# EasyEDA Pro project ProPrj_Low Taper Fade_2026-04-30 (1).epro

# Schematic Schematic1
Board Name: Board1; Create Date: 2026-04-27; Page Name: P1; Project Name: Low Taper Fade; Schematic Name: Schematic1; Update Date: 2026-04-28; Company: EasyEDA.com; Page Size: A4; Version: V1.0
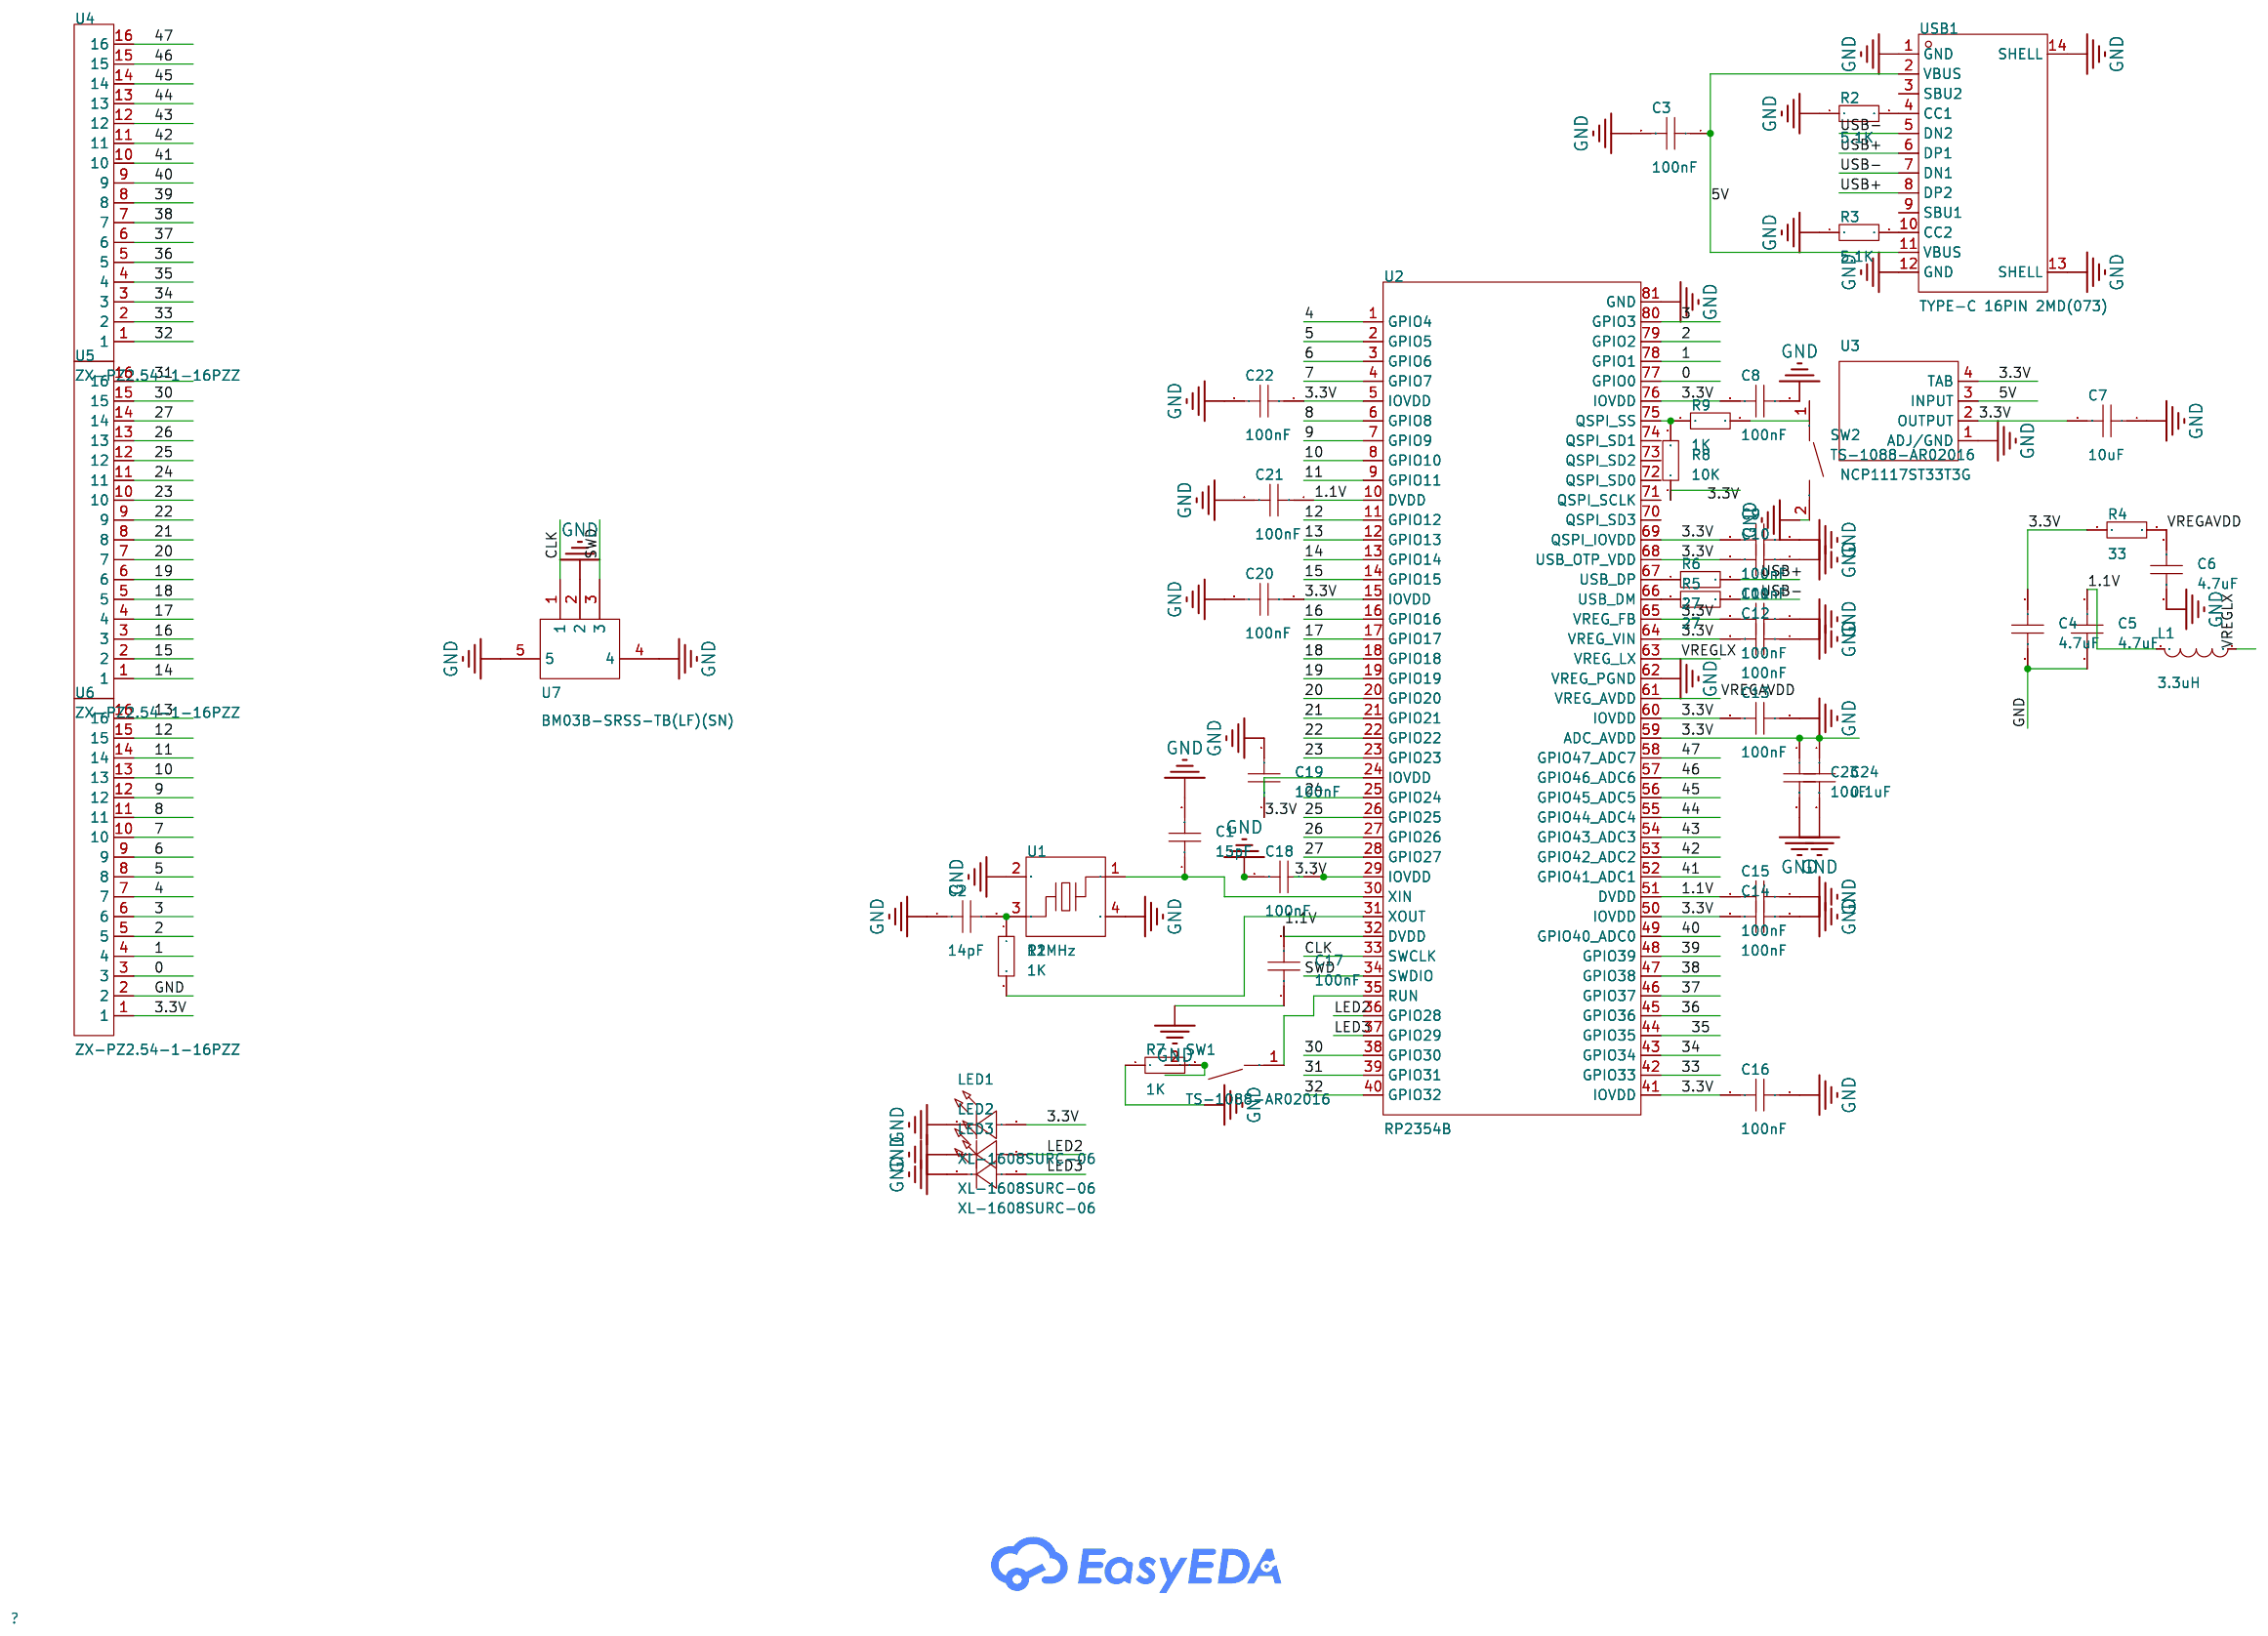
[diagram p0: schematic sheet]

## Parts
C1  15pF  [C0603]
C2  14pF  [C0603]
C3  100nF  [C0603]
C4  4.7uF  [C0603]
C5  4.7uF  [C0603]
C6  4.7uF  [C0603]
C7  10uF  [C0603]
C8  100nF  [C0603]
C9  100nF  [C0603]
C10  100nF  [C0603]
C11  100nF  [C0603]
C12  100nF  [C0603]
C13  100nF  [C0603]
C14  100nF  [C0603]
C15  100nF  [C0603]
C16  100nF  [C0603]
C17  100nF  [C0603]
C18  100nF  [C0603]
C19  100nF  [C0603]
C20  100nF  [C0603]
C21  100nF  [C0603]
C22  100nF  [C0603]
C23  10uF  [C0603]
C24  0.1uF  [C0603]
L1  3.3uH  [IND-SMD_L2.0-W1.6_AOTA-B201610S3R3-101-T]
LED1  XL-1608SURC-06  [LED0603-RD_RED]
LED2  XL-1608SURC-06  [LED0603-RD_RED]
LED3  XL-1608SURC-06  [LED0603-RD_RED]
R1  1K  [R0603]
R2  5.1K  [R0603]
R3  5.1K  [R0603]
R4  33  [R0603]
R5  27  [R0603]
R6  27  [R0603]
R7  1K  [R0603]
R8  10K  [R0603]
R9  1K  [R0603]
SW1  TS-1088-AR02016  [SW-SMD_L3.9-W3.0-P4.45]
SW2  TS-1088-AR02016  [SW-SMD_L3.9-W3.0-P4.45]
U1  12MHz  [CRYSTAL-SMD_4P-L3.2-W2.5-BL]
U2  RP2354B  [QFN-80_L10.0-W10.0-P0.40-TL-EP3.4]
U3  NCP1117ST33T3G  [SOT-223-3_L6.5-W3.4-P2.30-LS7.0-BR]
U4  ZX-PZ2.54-1-16PZZ  [HDR-TH_16P-P2.54-V-M-2]
U5  ZX-PZ2.54-1-16PZZ  [HDR-TH_16P-P2.54-V-M-2]
U6  ZX-PZ2.54-1-16PZZ  [HDR-TH_16P-P2.54-V-M-2]
U7  BM03B-SRSS-TB(LF)(SN)  [CONN-SMD-3P-P1.00_BM03B-SRSS-TB-LF-SN]
USB1  TYPE-C 16PIN 2MD(073)  [USB-C-SMD_TYPE-C-6PIN-2MD-073]

## Library data of the parts
C1-C24 = CAP_0603: Supplier Footprint: 0603
L1 = AOTA-B201610S3R3-101-T: Inductance:3.3uH Current Rating:2.1A Current - Saturation(Isat):2.4A DC Resistance(DCR):115mΩ Type:Molded Inductor; LCSC Part Name: 3.3uH 2.4A; Supplier Part: C42411119; Manufacturer: ABRACON; Supplier Footprint: 0806; JLCPCB Part Class: Extended Part; Datasheet: https://item.szlcsc.com/datasheet/AOTA-B201610S3R3-101-T/44392932.html; Supplier: LCSC; Current Rating: 2.1A; Current - Saturation(Isat): 2.4A; DC Resistance(DCR): 115mΩ; Type: Molded Inductor
LED1-LED3 = XL-1608SURC-06: Lamp Holder Type:- Illumination Color:Red Voltage - Forward(Vf):2.3V Voltage - Forward(Vf):2.3V Power(Watts):50mW Forward Current:20mA Wavelength - Dominant:620nm~630nm Wavelength - Dominant:620nm~630nm Peak Wavelength:625nm Diode Configuration:Discrete D; LCSC Part Name: 0603红色贴片式发光二极管; Supplier Part: C965799; Manufacturer: XINGLIGHT(成兴光); Supplier Footprint: 0603; JLCPCB Part Class: Extended Part; Datasheet: https://item.szlcsc.com/datasheet/XL-1608SURC-06/1051408.html; Supplier: LCSC; Illumination Color: Red; Voltage - Forward(Vf): 2.3V; Power(Watts): 50mW; Forward Current: 20mA; Wavelength - Dominant: 620nm~630nm; Peak Wavelength: 625nm; Diode Configuration: Discrete Diode; Lens Color: Water Clear; Luminous Intensity: 225mcd; Viewing Angle: 120°; Mounting Style: Top-mount; Operating Temperature: -40℃~+85℃
R1-R9 = Res_0603: Supplier Footprint: 0603
SW1 SW2 = TS-1088-AR02016: Circuit:SPST Actuator Style:Round Button Operating Force:1.6N Mounting Type:Surface Mount,Vertical Length:4mm Width:3mm Switch Height:2mm with Bracket:Without Bracket Contact Current:50mA Voltage Rating:12V Actuator/Cap Color:Black Termination Style:SMD(S; LCSC Part Name: 4*3*2mm 立贴 轻触开关; Supplier Part: C720477; Manufacturer: XUNPU(讯普); Supplier Footprint: SMD,4x3mm; JLCPCB Part Class: Basic Part; Datasheet: https://item.szlcsc.com/datasheet/TS-1088-AR02016/763484.html; Supplier: LCSC; Circuit: SPST; Actuator Style: Round Button; Operating Force: 1.6N; Mounting Type: Surface Mount,Vertical; Length: 4mm; Width: 3mm; Switch Height: 2mm; with Bracket: Without Bracket; Contact Current: 50mA; Voltage Rating: 12V; Actuator/Cap Color: Black; Termination Style: SMD(SMT) Tab; Life: 100,000 Cycles; Operating Temperature: -30℃~+80℃
U1 = ABM8-272-T3_C20625731: Type:Crystal Oscillator Frequency:12MHz Normal temperature Frequency Tolerance:±30ppm Normal temperature Frequency Tolerance:±30ppm Load Capacitance:10pF Frequency Stability:±30ppm Frequency Stability:±30ppm Equivalent Series Resistance(ESR):50Ω Operating; LCSC Part Name: 12MHz ±30ppm 10pF; Supplier Part: C20625731; Manufacturer: ABRACON; Manufacturer Part: ABM8-272-T3; Supplier Footprint: SMD3225-4P; JLCPCB Part Class: Extended Part; Datasheet: https://item.szlcsc.com/datasheet/ABM8-272-T3/22032038.html; Supplier: LCSC; Type: Crystal Oscillator; Normal temperature Frequency Tolerance: ±30ppm; Load Capacitance: 10pF; Frequency Stability: ±30ppm; Equivalent Series Resistance(ESR): 50Ω; Operating Temperature: -40℃~+85℃
U2 = RP2354B_C39843328: Features:True random number generator (TRNG)；External pin reset (NRST); LCSC Part Name: 高性能安全微控制器; Supplier Part: C39843328; Manufacturer: Raspberry Pi(树莓派); Supplier Footprint: QFN-80-EP(10x10); JLCPCB Part Class: Extended Part; Datasheet: https://item.szlcsc.com/datasheet/RP2354B/41574627.html; Supplier: LCSC; Features: True random number generator (TRNG)；External pin reset (NRST)
U3 = NCP1117ST33T3G: Output Type:Fixed Voltage - Supply:20V Output Voltage:3.3V Output Voltage:3.3V Output Current:1A Power Supply Rejection Ratio (PSRR):62dB@(120Hz) Voltage Dropout:1.2V@(800mA) standby current:6mA Noise:0.003%Vout Features:Thermal Shutdown；Over Current Prot; LCSC Part Name: 3.3V 1A 20V; Supplier Part: C26537; Manufacturer: onsemi(安森美); Supplier Footprint: SOT-223; JLCPCB Part Class: Extended Part; Datasheet: https://item.szlcsc.com/datasheet/NCP1117ST33T3G/27282.html; Supplier: LCSC; Output Type: Fixed; Voltage - Supply: 20V; Output Voltage: 3.3V; Output Current: 1A; Power Supply Rejection Ratio (PSRR): 62dB@(120Hz); Voltage Dropout: 1.2V@(800mA); standby current: 6mA; Noise: 0.003%Vout; Features: Thermal Shutdown；Over Current Protection; Operating Temperature: 0℃~+125℃@(Ta); Output Configuration: Positive; Number of Outputs: 1
U4-U6 = ZX-PZ2.54-1-16PZZ: Pin Structure:1x16P Pitch:2.54mm Row Spacing:- Circluar Pins/Square Pins:Pin Header Mounting Type:Through Hole Number of Rows:1 Number of Pins:16P Current Rating:3A Voltage Rating (Max):- Length of Mating Pin:6mm Insulation Height:2.5mm Length of End Conn; LCSC Part Name: 1x16P 间距:2.54mm 方针 直插; Supplier Part: C7501270; Manufacturer: Megastar(兆星); Supplier Footprint: 插件,P=2.54mm; JLCPCB Part Class: Extended Part; Datasheet: https://item.szlcsc.com/datasheet/ZX-PZ2.54-1-16PZZ/8582483.html; Supplier: LCSC; Pin Structure: 1x16P; Pitch: 2.54mm; Circluar Pins/Square Pins: Pin Header; Mounting Type: Through Hole; Number of Rows: 1; Number of Pins: 16P; Current Rating: 3A; Length of Mating Pin: 6mm; Insulation Height: 2.5mm; Length of End Connection Pin: 3mm; Contact Material: Brass; Contact Plating: Gold; Operating Temperature: -40℃~+105℃; Color: Black
U7 = BM03B-SRSS-TB(LF)(SN): Pins Structure:1x3P Pitch:1mm Mounting Type:Surface Mount,Vertical Reference Series:SH Number of Pins:3P Number of Rows:1 Number of PINs Per Row:3 Row Spacing:- Current Rating:1A Contact Material:Copper Alloy Contact Plating:Tin Operating Temperature:-25℃; LCSC Part Name: 1x3P 间距:1mm 立贴 系列:SH; Supplier Part: C160389; Manufacturer: JST; Supplier Footprint: SMD,P=1mm; JLCPCB Part Class: Extended Part; Datasheet: https://item.szlcsc.com/datasheet/BM03B-SRSS-TB(LF)(SN)/171769.html; Supplier: LCSC; Pins Structure: 1x3P; Pitch: 1mm; Mounting Type: Surface Mount,Vertical; Reference Series: SH; Number of Pins: 3P; Number of Rows: 1; Number of PINs Per Row: 3; Current Rating: 1A; Contact Material: Copper Alloy; Contact Plating: Tin; Operating Temperature: -25℃~+85℃; Voltage Rating: 50V; Plastic Material: PA; Flame Retardant Rating: UL94V-0; Supplementary Features: Auxiliary Solder Pin; Color: White; Z-Height of the Board: 4.25mm; X-Length of Bottom Edge on Board (Spacing Line): 5mm; Y-Width of Bottom Edge on Board: 3.6mm
USB1 = TYPE-C 16PIN 2MD(073): Connector Type:Type-C Protocol Standard:- Gender:Female Mounting Type:Surface Mount, Right Angle Number of Contacts:16P Number of Ports:1 Current Rating-Power:3A Voltage Rating:5V Connect-Disconnect Life:10,000 Cycles Supplementary Features:- Center Heigh; LCSC Part Name: Type-C 母 卧贴; Supplier Part: C2765186; Manufacturer: SHOU HAN(首韩); Supplier Footprint: SMD; JLCPCB Part Class: Extended Part; Datasheet: https://item.szlcsc.com/datasheet/TYPE-C%252016PIN%25202MD(073)/2901843.html; Supplier: LCSC; Connector Type: Type-C; Gender: Female; Mounting Type: Surface Mount, Right Angle; Number of Contacts: 16P; Number of Ports: 1; Current Rating-Power: 3A; Voltage Rating: 5V; Connect-Disconnect Life: 10,000 Cycles; Detection color: Black; Operating Temperature: -25℃~+85℃

## Nets
1.1V: C5.1 C15.2 C17.2 C21.1 L1.2 U2.10(DVDD) U2.32(DVDD) U2.51(DVDD)
3.3V: C4.1 C7.2 C8.2 C9.2 C10.2 C11.2 C12.2 C13.2 C14.2 C16.2 C18.1 C19.1 C20.1 C22.1 C23.1 C24.1 LED1.2(A) R4.1 R8.1 U2.5(IOVDD) U2.15(IOVDD) U2.24(IOVDD) U2.29(IOVDD) U2.41(IOVDD) U2.50(IOVDD) U2.59(ADC_AVDD) U2.60(IOVDD) U2.64(VREG_VIN) U2.65(VREG_FB) U2.68(USB_OTP_VDD) U2.69(QSPI_IOVDD) U2.76(IOVDD) U3.2(OUTPUT) U3.4(TAB) U6.1
5V: C3.1 U3.3(INPUT) USB1.2(VBUS) USB1.11(VBUS)
GND: C1.2 C2.1 C3.2 C4.2 C5.2 C6.2 C7.1 C8.1 C9.1 C10.1 C11.1 C12.1 C13.1 C14.1 C15.1 C16.1 C17.1 C18.2 C19.2 C20.2 C21.2 C22.2 C23.2 C24.2 LED1.1(K) LED2.1(K) LED3.1(K) R2.1 R3.1 R7.1 SW2.2 U1.2(GND) U1.4(GND) U2.62(VREG_PGND) U2.81(GND) U3.1(ADJ/GND) U6.2 U7.2 U7.4 U7.5 USB1.1(GND) USB1.12(GND) USB1.13(SHELL) USB1.14(SHELL)
0: U2.77(GPIO0) U6.3
1: U2.78(GPIO1) U6.4
2: U2.79(GPIO2) U6.5
3: U2.80(GPIO3) U6.6
4: U2.1(GPIO4) U6.7
5: U2.2(GPIO5) U6.8
6: U2.3(GPIO6) U6.9
7: U2.4(GPIO7) U6.10
8: U2.6(GPIO8) U6.11
9: U2.7(GPIO9) U6.12
10: U2.8(GPIO10) U6.13
11: U2.9(GPIO11) U6.14
12: U2.11(GPIO12) U6.15
13: U2.12(GPIO13) U6.16
14: U2.13(GPIO14) U5.1
15: U2.14(GPIO15) U5.2
16: U2.16(GPIO16) U5.3
17: U2.17(GPIO17) U5.4
18: U2.18(GPIO18) U5.5
19: U2.19(GPIO19) U5.6
20: U2.20(GPIO20) U5.7
21: U2.21(GPIO21) U5.8
22: U2.22(GPIO22) U5.9
23: U2.23(GPIO23) U5.10
24: U2.25(GPIO24) U5.11
25: U2.26(GPIO25) U5.12
26: U2.27(GPIO26) U5.13
27: U2.28(GPIO27) U5.14
30: U2.38(GPIO30) U5.15
31: U2.39(GPIO31) U5.16
32: U2.40(GPIO32) U4.1
33: U2.42(GPIO33) U4.2
34: U2.43(GPIO34) U4.3
35: U2.44(GPIO35) U4.4
36: U2.45(GPIO36) U4.5
37: U2.46(GPIO37) U4.6
38: U2.47(GPIO38) U4.7
39: U2.48(GPIO39) U4.8
40: U2.49(GPIO40_ADC0) U4.9
41: U2.52(GPIO41_ADC1) U4.10
42: U2.53(GPIO42_ADC2) U4.11
43: U2.54(GPIO43_ADC3) U4.12
44: U2.55(GPIO44_ADC4) U4.13
45: U2.56(GPIO45_ADC5) U4.14
46: U2.57(GPIO46_ADC6) U4.15
47: U2.58(GPIO47_ADC7) U4.16
CLK: U2.33(SWCLK) U7.1
LED2: LED2.2(A) U2.36(GPIO28)
LED3: LED3.2(A) U2.37(GPIO29)
SWD: U2.34(SWDIO) U7.3
USB+: R6.2 USB1.6(DP1) USB1.8(DP2)
USB-: R5.2 USB1.5(DN2) USB1.7(DN1)
VREGAVDD: C6.1 R4.2 U2.61(VREG_AVDD)
VREGLX: L1.1 U2.63(VREG_LX)
$1N996: C1.1 U1.1 U2.30(XIN)
$1N1154: C2.2 R1.1 U1.3
$1N1283: R1.2 U2.31(XOUT)
$1N1709: R2.2 USB1.4(CC1)
$1N1735: R3.2 USB1.10(CC2)
$1N2843: R5.1 U2.66(USB_DM)
$1N2869: R6.1 U2.67(USB_DP)
$1N3149: R8.2 R9.2 U2.75(QSPI_SS)
Net-(R7-2): R7.2 SW1.2
Net-(R9-1): R9.1 SW2.1
Net-(SW1-1): SW1.1 U2.35(RUN)

Not connected (* = marked no-connect by the designer): U2 70(QSPI_SD3) 71(QSPI_SCLK) 72(QSPI_SD0) 73(QSPI_SD2) 74(QSPI_SD1); USB1 3(SBU2) 9(SBU1)

# Board PCB2
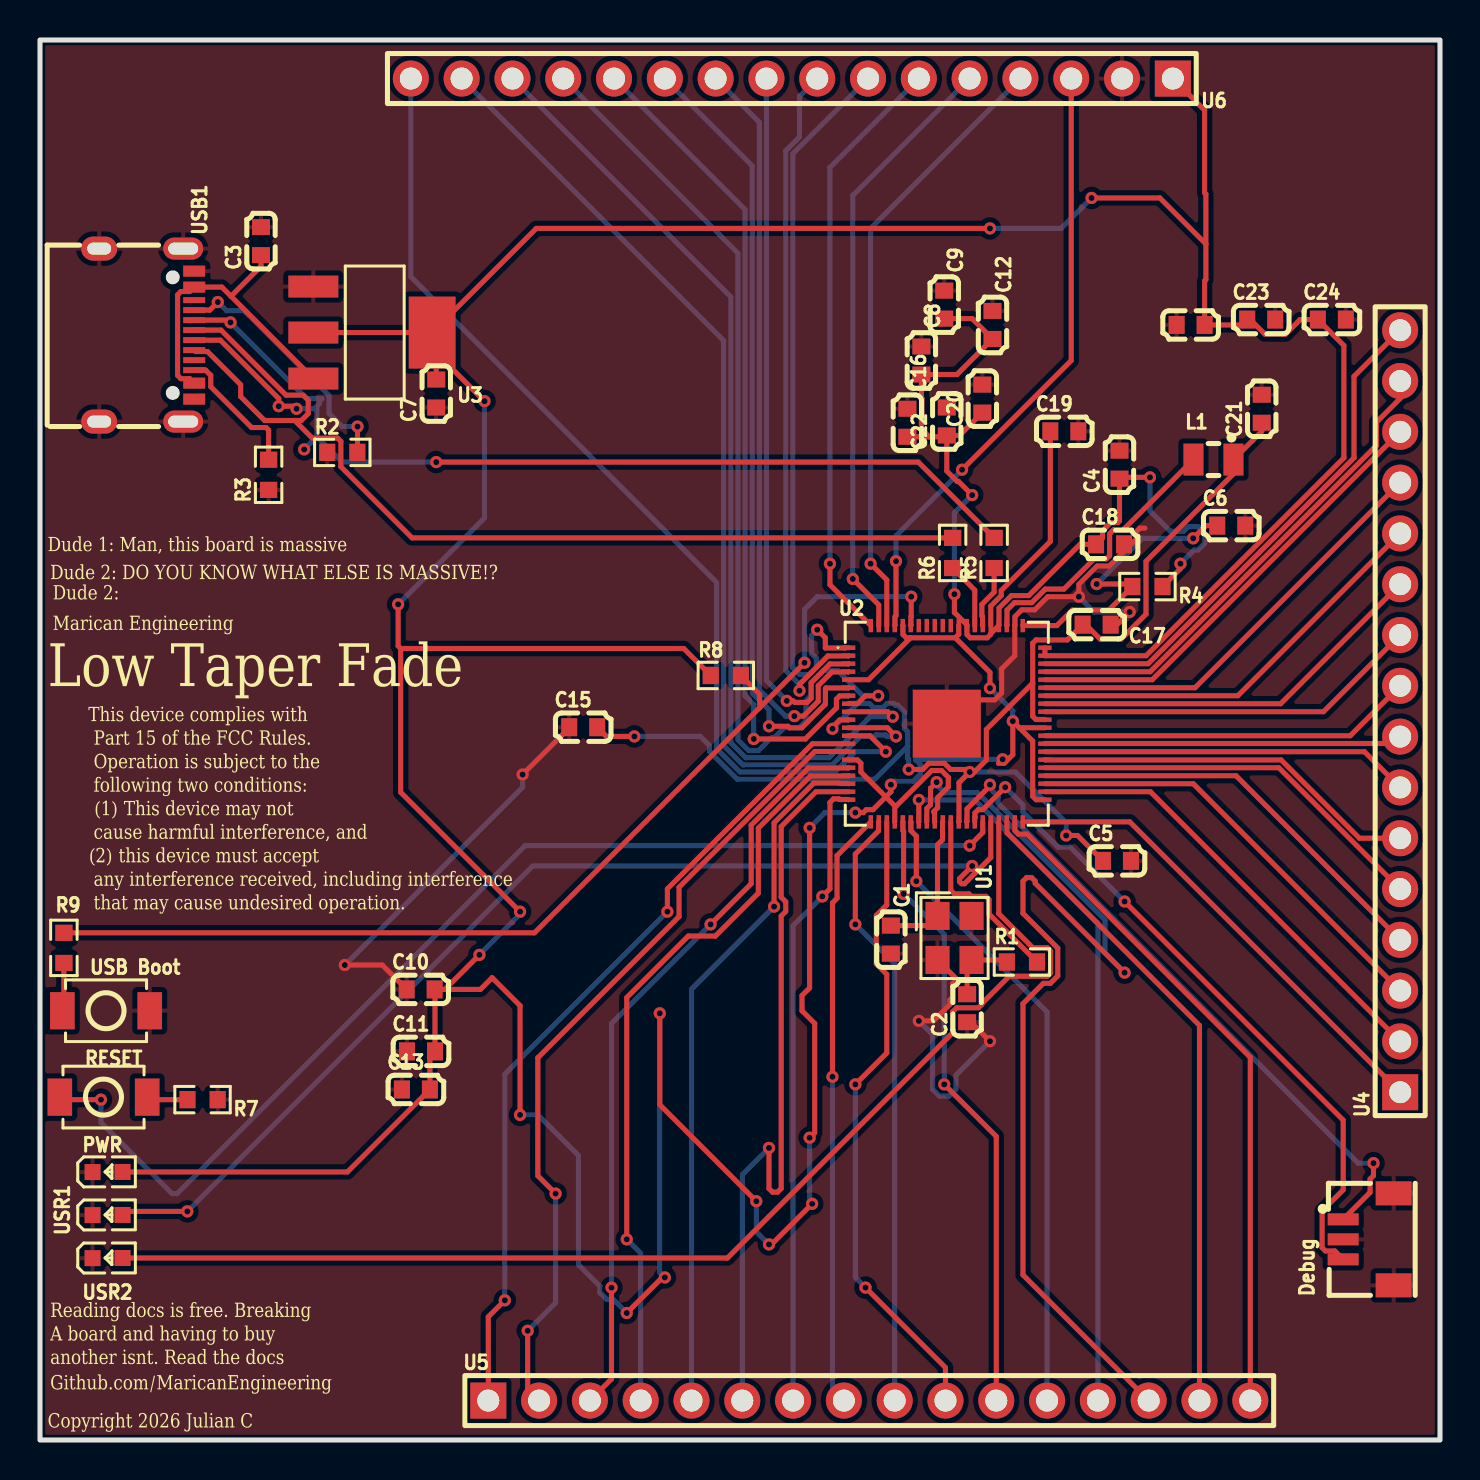
[diagram p1: board, top side]
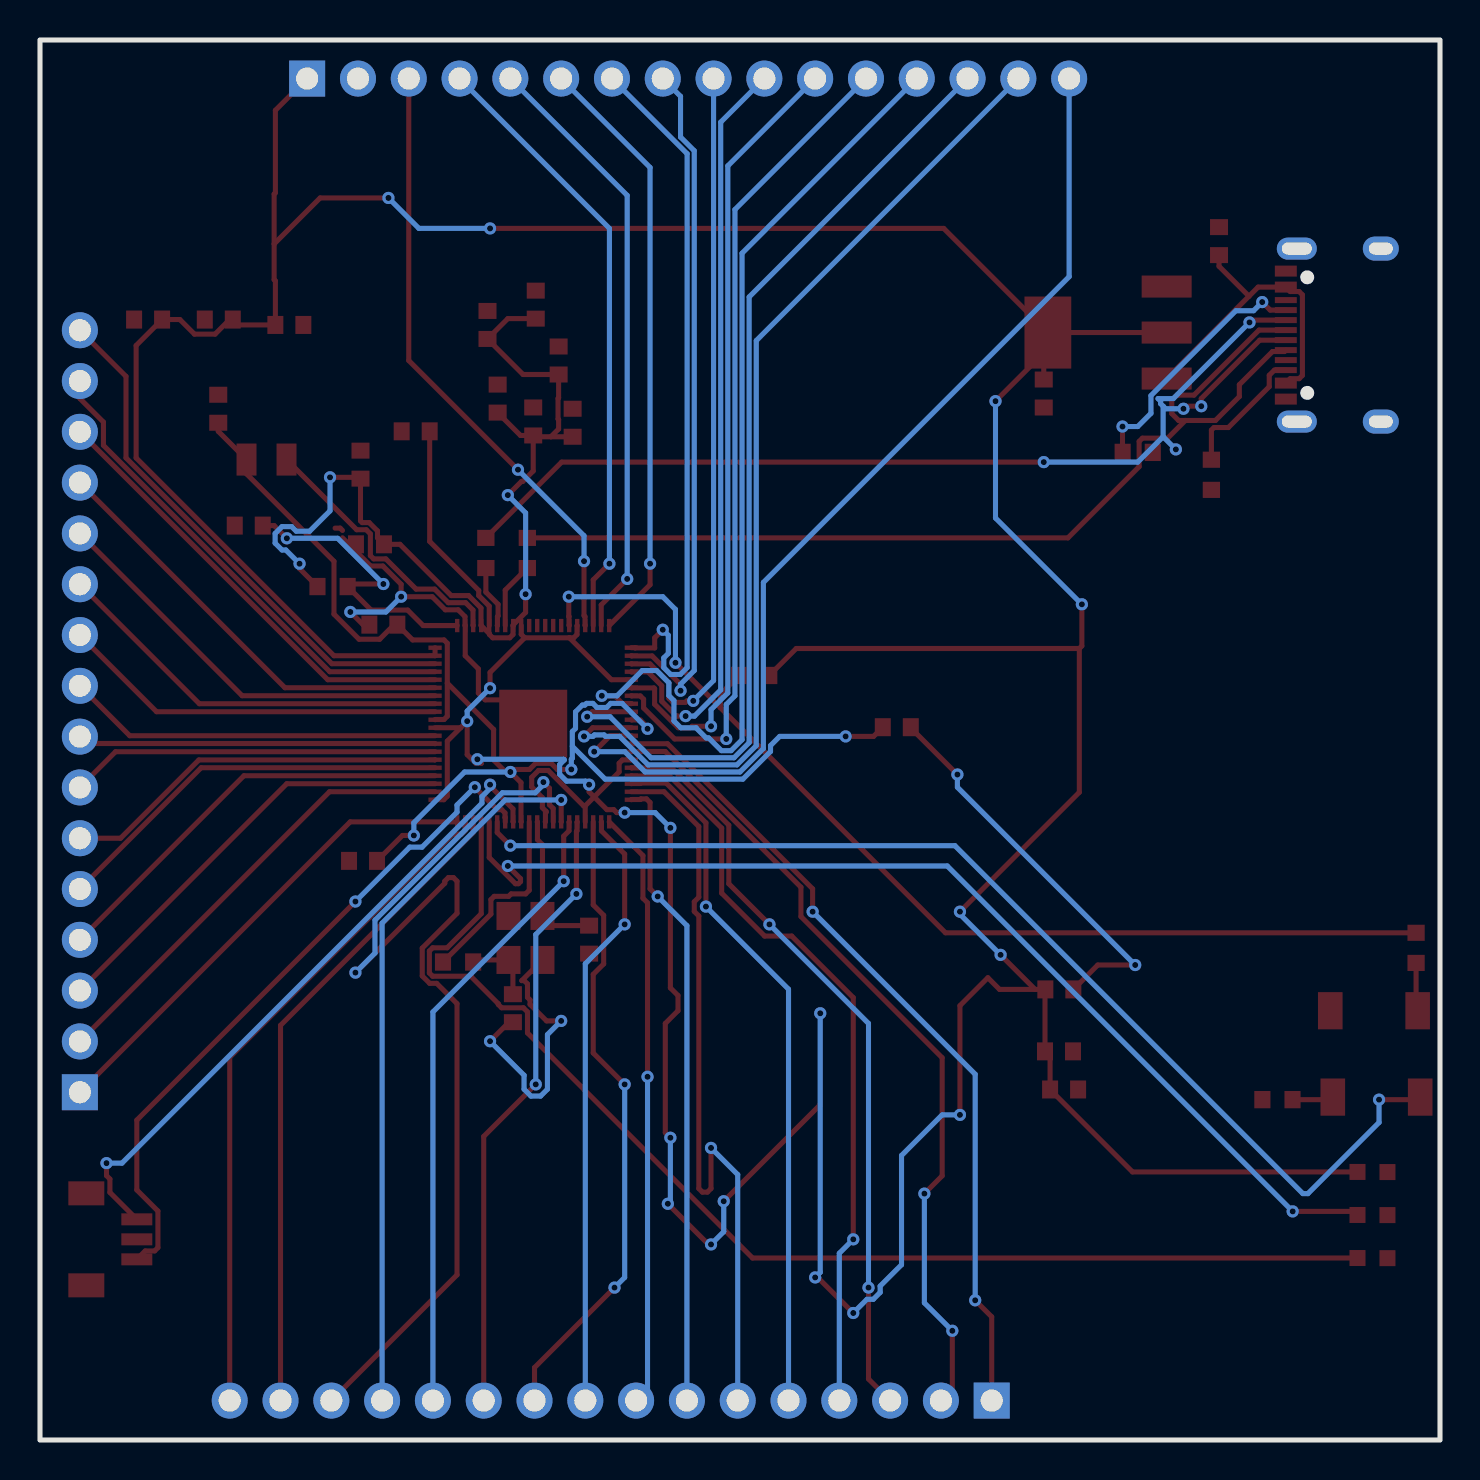
[diagram p2: board, bottom side, seen from below]

Outline 70 x 70 mm; copper layers: Top Layer, Bottom Layer. Coordinates in mm from the lower left corner of the outline.
Outline path: rectangle 0,70 70,0
Stack: Top Layer 0.035mm / Dielectric1 1.51mm FR4 er 4.5 / Bottom Layer 0.035mm

## Design rules (mm)
template: JLCPCB Capability(Two Layers Board)
spacing copperThickness1oz (default): track to track 0.102, other pairs 0.152 to 0.3
spacing copperThickness2oz: track to track 0.203, other pairs 0.152 to 0.3
track width copperThickness1oz (default): min 0.127, default 0.254, max 2.54
track width copperThickness2oz: min 0.203, default 0.254, max 2.54
differential pair differentialPair (default): width min 0.127, default 0.254, max 2.54; gap min 0.152, default 0.152
via viaSize (default): diameter min 0.5, default 0.61, max 10; hole min 0.3, default 0.305, max 6.3

## Placement (name value [footprint] x y rotation side)
C1  15pF  [C0603]  42.54 25.02 270 top
C2  14pF  [C0603]  46.35 21.59 90 top
C3  100nF  [C0603]  11.05 59.94 90 top
C4  4.7uF  [C0603]  53.97 48.77 90 top
C5  4.7uF  [C0603]  53.85 28.96 0 top
C6  4.7uF  [C0603]  59.56 45.72 0 top
C7  10uF  [C0603]  19.81 52.32 90 top
C8  100nF  [C0603]  44.07 53.97 270 top
C9  100nF  [C0603]  45.21 56.77 270 top
C10  100nF  [C0603]  19.03 22.53 0 top
C11  100nF  [C0603]  19.05 19.43 0 top
C12  100nF  [C0603]  47.62 55.75 270 top
C13  100nF  [C0603]  18.8 17.53 0 top
C14  100nF  [C0603]  57.53 55.75 0 top
C15  100nF  [C0603]  27.16 35.64 0 top
C16  100nF  [C0603]  43.37 50.86 270 top
C17  100nF  [C0603]  52.83 40.77 180 top
C18  100nF  [C0603]  53.5 44.78 0 top
C19  100nF  [C0603]  51.22 50.43 0 top
C20  100nF  [C0603]  47.12 52.07 90 top
C21  100nF  [C0603]  61.09 51.56 90 top
C22  100nF  [C0603]  45.34 50.93 90 top
C23  10uF  [C0603]  61.06 56.02 0 top
C24  0.1uF  [C0603]  64.59 56.02 0 top
Debug  BM03B-SRSS-TB(LF)(SN)  [CONN-SMD-3P-P1.00_BM03B-SRSS-TB-LF-SN]  66.42 10.03 90 top
L1  3.3uH  [IND-SMD_L2.0-W1.6_AOTA-B201610S3R3-101-T]  58.67 49.02 0 top
PWR  XL-1608SURC-06  [LED0603-RD_RED]  3.38 13.4 0 top
R1  1K  [R0603]  49.1 23.9 0 top
R2  5.1K  [R0603]  15.11 49.38 0 top
R3  5.1K  [R0603]  11.43 48.26 90 top
R4  33  [R0603]  55.37 42.67 180 top
R5  27  [R0603]  47.71 44.35 90 top
R6  27  [R0603]  45.63 44.35 90 top
R7  1K  [R0603]  8.13 17.02 180 top
R8  10K  [R0603]  34.29 38.23 0 top
R9  1K  [R0603]  1.2 24.61 90 top
RESET  TS-1088-AR02016  [SW-SMD_L3.9-W3.0-P4.45]  3.17 17.14 0 top
U1  12MHz  [CRYSTAL-SMD_4P-L3.2-W2.5-BL]  45.73 25.1 270 top
U2  RP2354B  [QFN-80_L10.0-W10.0-P0.40-TL-EP3.4]  45.34 35.81 0 top
U3  NCP1117ST33T3G  [SOT-223-3_L6.5-W3.4-P2.30-LS7.0-BR]  16.64 55.37 180 top
U4  ZX-PZ2.54-1-16PZZ  [HDR-TH_16P-P2.54-V-M-2]  68.01 36.44 90 top
U5  ZX-PZ2.54-1-16PZZ  [HDR-TH_16P-P2.54-V-M-2]  41.46 1.97 0 top
U6  ZX-PZ2.54-1-16PZZ  [HDR-TH_16P-P2.54-V-M-2]  37.59 68.07 180 top
USB1  TYPE-C 16PIN 2MD(073)  [USB-C-SMD_TYPE-C-6PIN-2MD-073]  5.33 55.25 270 top
USB Boot  TS-1088-AR02016  [SW-SMD_L3.9-W3.0-P4.45]  3.3 21.46 0 top
USR1  XL-1608SURC-06  [LED0603-RD_RED]  3.38 11.25 0 top
USR2  XL-1608SURC-06  [LED0603-RD_RED]  3.38 9.1 0 top

## Footprints (pads in the part's own frame, mm; a bottom-side part is the same pattern mirrored in y, then rotated)
C0603
  rect 0.8x0.9 smd: 1(-0.7,0) 2(0.7,0)
CONN-SMD-3P-P1.00_BM03B-SRSS-TB-LF-SN
  rect 0.6x1.55 smd: 1(1,1.262) 2(0,1.262) 3(-1,1.262)
  rect 1.2x1.8 smd: 4(2.3,-1.262) 5(-2.3,-1.262)
CRYSTAL-SMD_4P-L3.2-W2.5-BL
  rect 1.4x1.2 smd: 1(-1.1,-0.85) 2(1.1,-0.85) 3(1.1,0.85) 4(-1.1,0.85)
HDR-TH_16P-P2.54-V-M-2
  rect 1.8x1.8 hole 1.1: 1(-19.05,0)
  round 1.8 hole 1.1: 2(-16.51,0) 3(-13.97,0) 4(-11.43,0) 5(-8.89,0) 6(-6.35,0) 7(-3.81,0) 8(-1.27,0) 9(1.27,0) 10(3.81,0) 11(6.35,0) 12(8.89,0) 13(11.43,0) 14(13.97,0) 15(16.51,0) 16(19.05,0)
IND-SMD_L2.0-W1.6_AOTA-B201610S3R3-101-T
  rect 1x1.6 smd: 1(-1,0) 2(1,0)
LED0603-RD_RED
  rect 0.8x0.8 smd: 1(-0.749,-0.004) 2(0.749,0.004)
QFN-80_L10.0-W10.0-P0.40-TL-EP3.4
  rect 0.665x0.22 smd: 1(-4.907,3.8) 2(-4.907,3.4) 3(-4.907,3) 4(-4.907,2.6) 5(-4.907,2.2) 6(-4.907,1.8) 7(-4.907,1.4) 8(-4.907,1) 9(-4.907,0.6) 10(-4.907,0.2) 11(-4.907,-0.2) 12(-4.907,-0.6) 13(-4.907,-1) 14(-4.907,-1.4) 15(-4.907,-1.8) 16(-4.907,-2.2) 17(-4.907,-2.6) 18(-4.907,-3) 19(-4.907,-3.4) 20(-4.907,-3.8) 41(4.907,-3.8) 42(4.907,-3.4) 43(4.907,-3) 44(4.907,-2.6) 45(4.907,-2.2) 46(4.907,-1.8) 47(4.907,-1.4) 48(4.907,-1) 49(4.907,-0.6) 50(4.907,-0.2) 51(4.907,0.2) 52(4.907,0.6) 53(4.907,1) 54(4.907,1.4) 55(4.907,1.8) 56(4.907,2.2) 57(4.907,2.6) 58(4.907,3) 59(4.907,3.4) 60(4.907,3.8)
  rect 0.22x0.665 smd: 21(-3.8,-4.907) 22(-3.4,-4.907) 23(-3,-4.907) 24(-2.6,-4.907) 25(-2.2,-4.907) 26(-1.8,-4.907) 27(-1.4,-4.907) 28(-1,-4.907) 29(-0.6,-4.907) 30(-0.2,-4.907) 31(0.2,-4.907) 32(0.6,-4.907) 33(1,-4.907) 34(1.4,-4.907) 35(1.8,-4.907) 36(2.2,-4.907) 37(2.6,-4.907) 38(3,-4.907) 39(3.4,-4.907) 40(3.8,-4.907) 61(3.8,4.907) 62(3.4,4.907) 63(3,4.907) 64(2.6,4.907) 65(2.2,4.907) 66(1.8,4.907) 67(1.4,4.907) 68(1,4.907) 69(0.6,4.907) 70(0.2,4.907) 71(-0.2,4.907) 72(-0.6,4.907) 73(-1,4.907) 74(-1.4,4.907) 75(-1.8,4.907) 76(-2.2,4.907) 77(-2.6,4.907) 78(-3,4.907) 79(-3.4,4.907) 80(-3.8,4.907)
  rect 3.4x3.4 smd: 81(0,0)
R0603
  rect 0.806x0.864 smd: 1(-0.753,0) 2(0.753,0)
SOT-223-3_L6.5-W3.4-P2.30-LS7.0-BR
  rect 2.5x1.1 smd: 1(2.97,-2.3) 2(2.97,0) 3(2.97,2.3)
  rect 2.34x3.6 smd: 4(-2.97,0)
SW-SMD_L3.9-W3.0-P4.45
  rect 1.23x1.86 smd: 1(-2.185,0) 2(2.185,0)
USB-C-SMD_TYPE-C-6PIN-2MD-073
  rect 0.55x1.1 smd: 1(-3.2,2.375) 2(-2.4,2.375) 11(2.4,2.375) 12(3.2,2.375)
  rect 0.3x1.1 smd: 3(-1.75,2.375) 4(-1.25,2.375) 5(-0.75,2.375) 6(-0.25,2.375) 7(0.25,2.375) 8(0.75,2.375) 9(1.25,2.375) 10(1.75,2.375)
  oval 1.1x2 hole 0.6x1.5: 13(-4.325,1.825) 14(4.325,1.825)
  oval 1.2x1.8 hole 0.6x1.2: 13(-4.325,-2.375) 14(4.325,-2.375)

## Nets
As in the schematic, except:
3.3V: C4.1 C7.2 C8.2 C9.2 C10.2 C11.2 C12.2 C13.2 C14.2 C16.2 C18.1 C19.1 C20.1 C22.1 C23.1 C24.1 PWR.2 R4.1 R8.1 U2.5 U2.15 U2.24 U2.29 U2.41 U2.50 U2.59 U2.60 U2.64 U2.65 U2.68 U2.69 U2.76 U3.2 U3.4 U6.1
GND: C1.2 C2.1 C3.2 C4.2 C5.2 C6.2 C7.1 C8.1 C9.1 C10.1 C11.1 C12.1 C13.1 C14.1 C15.1 C16.1 C17.1 C18.2 C19.2 C20.2 C21.2 C22.2 C23.2 C24.2 Debug.2 Debug.4 Debug.5 PWR.1 R2.1 R3.1 R7.1 U1.2 U1.4 U2.62 U2.81 U3.1 U6.2 USB1.1 USB1.12 USB1.13 USB1.14 USB Boot.2 USR1.1 USR2.1
CLK: Debug.1 U2.33
LED2: U2.36 USR1.2
LED3: U2.37 USR2.2
SWD: Debug.3 U2.34
$1N3024: RESET.1 U2.35
$1N3050: R7.2 RESET.2
$1N3281: R9.1 USB Boot.1

Pads without a net: U2 70 71 72 73 74; USB1 3 9

## Via types
v1: diameter 0.61, hole 0.305, Top Layer to Bottom Layer, 89 vias

## Routing (per net, layer and track width the routed paths; a pad name or vN(x,y) marks a point on that pad's centre or on a via; arc(x,y) is an arc through that point)
1.1V: length 69.9
  Top Layer w0.254: v1(46.48,33.4) 46.72,33.4 47.32,34 47.32,35.53 49.63,37.84 ; v1(46.48,33.4) 45.95,32.87 45.95,30.92 U2.32 ; v1(46.48,33.4) 46.35,33.53 45.53,33.53 45.22,33.83 44.44,33.83 44.14,33.53 v1(43.43,33.53) ; C15.2 28.32,35.18 v1(29.72,35.18) ; 49.63,37.84 49.63,36.19 49.8,36.03 50.24,36.03 U2.51 ; 49.63,37.84 49.63,39.84 49.8,40 51.37,40 C17.2 52.29,40.77 53.02,40.04 54.05,40.04 55.3,41.29 55.3,43.94 59.67,48.31 L1.2 61.09,50.44 C21.1 ; v1(39.62,35.56) 39.62,35.64 39.98,36 40.42,36 U2.10 ; v1(51.31,30.23) 51.88,30.23 C5.1
  Bottom Layer w0.254: 43.38,34.68 41.74,33.04 34.86,33.04 33.47,34.43 33.47,34.72 33.01,35.18 v1(29.72,35.18) ; 43.38,34.68 43.38,34.09 43.43,34.04 v1(43.43,33.53) ; 43.38,34.68 43.38,35.42 43.22,35.58 43.22,36.41 42.88,36.75 42.75,36.75 42.67,36.83 42.35,36.83 42.15,36.63 41.67,36.63 41.47,36.83 40.89,36.83 v1(39.62,35.56) ; v1(51.31,30.23) 51.31,30.86 48.77,33.4 v1(46.48,33.4)
3.3V: length 353.2
  Top Layer w0.254: v1(24,26.42) 18.03,32.39 18.03,39.58 ; C22.1 45.34,48.45 45.86,47.93 45.92,47.93 v1(46.61,47.24) ; C22.1 45.97,50.23 C20.1 ; C22.1 45.27,50.16 44.46,50.16 ; U2.15 40.44,34 40.88,34 41.04,33.84 41.04,33.4 42.29,32.15 ; C7.2 19.81,54.36 v1(22.22,51.94) ; 44.46,50.16 44.07,50.55 44.07,51.02 44.1,51.05 44.1,52.08 44.07,52.11 44.07,53.28 45.85,53.28 C12.2 46.61,56.07 C9.2 ; 44.46,50.16 C16.2 ; 60.52,56.02 60.36,56.02 ; 60.52,56.02 60.25,55.75 C14.2 58.23,57.95 58.29,58.02 58.29,59.8 ; 60.52,56.02 61.25,55.29 62.28,55.29 63.01,56.02 C24.1 65.19,54.72 65.19,49.11 55.3,39.21 U2.59 U2.60 ; v1(42.54,32.77) 42.54,32.41 42.29,32.15 ; U2.41 49.81,32.01 49.63,32.19 49.63,34.95 48.97,35.61 ; v1(38.48,30.61) 38.48,22.61 38.1,22.22 38.1,21.46 38.74,20.83 38.74,15.37 v1(38.48,15.11) ; U2.5 41.43,38.01 43.53,40.11 ; v1(57.02,43.81) 57.02,43.57 R4.1 ; v1(55.5,48.13) 54.04,48.13 C4.1 53.97,45.96 53.89,45.87 53.54,45.87 53.12,45.45 53.12,45.11 C18.1 52,44.78 49.44,42.22 48.57,42.22 47.95,41.6 47.95,40.73 U2.64 47.53,40.31 47.53,40.27 47.36,40.11 46.51,40.11 46.35,40.27 46.35,40.71 U2.68 46.34,40.76 45.72,41.38 v1(45.72,42.29) ; 48.97,35.61 v1(48.64,35.94) 48.64,34.27 48.21,33.83 47.93,33.83 v1(48.13,34.04) ; 48.97,35.61 U2.50 ; v1(30.99,21.34) 30.99,16.76 v1(35.81,11.94) ; 58.29,59.8 55.99,62.1 v1(52.58,62.1) ; 58.29,59.8 58.29,62.3 58.23,62.36 58.23,66.48 U6.1 ; 20.24,22.53 C10.2 19.75,22.51 C11.2 19.5,19.18 C13.2 15.37,13.4 PWR.2 ; 20.24,22.53 v1(21.97,24.26) ; 20.24,22.53 22.02,22.53 22.61,23.11 24,21.72 v1(24,16.26) ; 43.53,40.11 43.31,40.11 43.15,40.27 43.15,40.71 U2.76 ; 43.53,40.11 45.76,40.11 ; 45.76,40.11 45.94,40.28 U2.69 ; 45.76,40.11 47.5,38.38 v1(47.5,37.59) ; U3.2 U3.4 24.81,60.58 v1(47.5,60.58) ; R8.1 32.19,39.58 18.03,39.58 ; 18.03,39.58 17.91,39.7 v1(17.91,41.78) ; v1(38.61,11.81) 36.58,9.78 v1(36.45,9.78) ; v1(40.77,31.37) 41.16,31.37 41.31,31.52 41.65,31.52 42.29,32.15 ; 42.74,31.71 U2.24 ; 42.74,31.71 42.29,32.15 ; 42.74,31.71 42.82,31.71 44.59,33.48 45.07,33.48 45.41,33.14 45.41,32.65 44.88,32.12 44.88,31.61 44.69,31.43 44.69,31.39 44.73,31.35 44.73,30.92 U2.29 ; U2.65 47.54,41.7 48.06,42.22 48.06,42.47 50.52,44.93 C19.1 ; v1(29.34,6.35) 31.12,8.13 v1(31.24,8.13)
  Bottom Layer w0.254: v1(57.02,43.81) 57.71,44.5 57.9,44.5 58.24,44.84 58.24,45.33 57.9,45.67 57.42,45.67 57.19,45.44 56.51,45.44 55.5,46.46 v1(55.5,48.13) ; v1(48.13,34.04) 43.81,34.04 43.79,34.01 43.79,34 44.02,33.77 44.02,33.29 43.68,32.94 42.72,32.94 v1(42.54,32.77) ; v1(21.97,24.26) 24,26.29 v1(24,26.42) ; v1(52.58,62.1) 51.05,60.58 v1(47.5,60.58) ; v1(38.48,15.11) 38.48,11.94 v1(38.61,11.81) ; v1(47.5,37.59) 48.64,36.45 v1(48.64,35.94) ; v1(22.22,51.94) 22.22,46.1 v1(17.91,41.78) ; v1(45.72,42.29) 45.72,46.36 v1(46.61,47.24) ; v1(36.45,9.78) 35.81,10.41 v1(35.81,11.94) ; v1(29.34,6.35) 28.65,7.04 28.33,7.04 27.99,7.38 27.99,7.7 26.92,8.76 26.92,14.22 24.89,16.26 v1(24,16.26) ; v1(30.99,21.34) 30.99,8.38 v1(31.24,8.13) ; v1(38.48,30.61) 39.24,31.37 v1(40.77,31.37)
5V: length 16.5
  Top Layer w0.254: USB1.11 7.49,53.07 7.04,53.07 6.88,53.23 6.88,57.26 7.04,57.42 7.49,57.42 7.71,57.64 9.09,57.64 9.55,57.19 ; 9.55,57.19 U3.3 ; 9.55,57.19 11.05,58.69 C3.1
GND: length 54.8
  Top Layer w0.254: C2.1 46.55,20.89 v1(47.5,19.94) ; v1(24.13,33.27) 26.46,35.61 C15.1 ; C17.1 53.85,40.77 v1(54.48,41.4) ; C10.1 17.11,23.75 v1(15.24,23.75) ; 54.88,45.48 54.99,45.59 55.25,45.59 ; U1.2 45.91,22.97 45.79,22.97 45.63,22.81 45.63,22.13 45.5,22 45.5,21.78 44.67,20.95 v1(43.94,20.95) ; 54.88,45.11 53.47,43.7 52.85,43.7 51.94,42.79 v1(51.94,42.16) 50.39,42.16 49.73,41.51 49.09,41.51 48.75,41.17 48.75,40.73 U2.62 48.74,39.21 48.08,38.56 48.08,37.35 47.74,37.01 46.53,37.01 U2.81
  Bottom Layer w0.254: v1(54.48,41.4) 52.71,41.4 v1(51.94,42.16) ; v1(15.24,23.75) 24.13,32.64 v1(24.13,33.27) ; v1(43.94,20.95) 44.63,20.27 44.63,17.54 44.97,17.2 45.45,17.2 45.8,17.54 45.8,18.24 v1(47.5,19.94)
0: length 31
  Top Layer w0.254: v1(42.8,43.94) 42.8,41.22 42.75,41.17 42.75,40.73 U2.77 ; U6.3 51.56,53.97 v1(46.1,48.51)
  Bottom Layer w0.254: v1(42.8,43.94) 42.8,45.21 v1(46.1,48.51)
1: length 30.8
  Top Layer w0.254: U2.78 42.34,43 v1(41.53,43.81)
  Bottom Layer w0.254: v1(41.53,43.81) 41.53,60.58 U6.4
2: length 30.3
  Top Layer w0.254: U2.79 41.94,41.75 v1(40.64,43.05)
  Bottom Layer w0.254: U6.5 40.64,62.23 v1(40.64,43.05)
3: length 30
  Top Layer w0.254: U2.80 39.5,42.76 v1(39.5,43.81)
  Bottom Layer w0.254: U6.6 39.5,63.63 v1(39.5,43.81)
4: length 36.8
  Top Layer w0.254: U2.1 40.25,39.61 40.24,39.6 39.27,39.6 39.27,40.11 v1(38.86,40.51)
  Bottom Layer w0.254: U6.7 37.64,64.31 37.64,38.62 37.99,38.28 38.47,38.28 38.81,38.62 38.81,39.1 38.58,39.33 38.58,40.23 v1(38.86,40.51)
5: length 34.9
  Top Layer w0.254: U2.2 40.42,39.2 39.39,39.2 37.97,37.78 v1(37.97,37.47)
  Bottom Layer w0.254: v1(37.97,37.47) 37.97,37.79 37.29,38.47 37.29,64.46 37.97,65.15 37.97,67.18 U6.8
6: length 35.9
  Top Layer w0.254: U2.3 40.42,38.8 39.5,38.8 38.56,37.86 38.56,37.09 38.35,36.88 37.73,36.88 37.66,36.96 v1(37.34,36.96)
  Bottom Layer w0.254: v1(37.34,36.96) 36.32,37.97 U6.9
7: length 37.9
  Top Layer w0.254: U2.4 40.42,38.4 39.6,38.4 38.91,37.72 38.91,36.94 38.17,36.19 v1(37.72,36.19)
  Bottom Layer w0.254: U6.10 35.97,65.89 35.97,37.5 37.27,36.19 v1(37.72,36.19)
8: length 39.8
  Top Layer w0.254: v1(36.45,35.69) 37.4,35.69 37.48,35.61 38.09,35.61 39.27,36.79 39.27,37.57 39.3,37.6 40.42,37.6 U2.6
  Bottom Layer w0.254: v1(36.45,35.69) 36.45,36.52 35.61,37.36 35.61,63.7 U6.11
9: length 41.8
  Top Layer w0.254: U2.7 40.42,37.2 39.98,37.2 39.82,37.04 39.82,36.6 38.27,35.05 v1(35.69,35.05)
  Bottom Layer w0.254: v1(35.69,35.05) 35.69,36.78 35.25,37.21 35.25,61.52 U6.12
10: length 48.7
  Top Layer w0.254: U2.8 40.44,36.83 40.88,36.83 41.27,37.21 v1(41.91,37.21)
  Bottom Layer w0.254: v1(41.91,37.21) 41.15,37.21 39.89,38.47 39.17,38.47 38.56,37.86 38.56,37.22 38.3,36.97 38.3,35.95 37.96,35.61 37.2,35.61 36.69,35.1 36.56,35.1 35.93,34.47 35.44,34.47 34.9,35.02 34.9,59.34 U6.13
11: length 49.3
  Top Layer w0.254: v1(42.64,36.16) 42.39,36.41 U2.9
  Bottom Layer w0.254: v1(42.64,36.16) 41.5,36.16 39.45,34.11 35.3,34.11 34.54,34.87 34.54,57.15 U6.14
12: length 51
  Top Layer w0.254: v1(42.8,35.18) 42.36,35.61 U2.11
  Bottom Layer w0.254: U6.15 34.19,54.97 34.19,34.72 35.15,33.76 39.59,33.76 41.02,35.18 41.72,35.18 41.79,35.25 42.28,35.25 42.35,35.18 v1(42.8,35.18)
13: length 51.4
  Top Layer w0.254: v1(42.29,34.42) 41.49,35.21 U2.12
  Bottom Layer w0.254: v1(42.29,34.42) 40.76,34.42 39.74,33.4 35,33.4 33.83,34.57 33.83,42.88 18.54,58.17 U6.16
14: length 41.4
  Top Layer w0.254: v1(23.24,6.99) 22.41,6.16 U5.1 ; U2.13 38.62,34.81 31.37,27.56 v1(31.37,26.42)
  Bottom Layer w0.254: v1(31.37,26.42) 23.24,18.29 v1(23.24,6.99)
15: length 41.1
  Top Layer w0.254: U2.14 40.42,34.42 38.74,34.42 31.95,27.64 31.95,26.17 24.89,19.11 24.89,13.21 v1(25.78,12.32) ; v1(24.38,5.46) 24.38,2.54 U5.2
  Bottom Layer w0.254: v1(25.78,12.32) 25.78,6.86 v1(24.38,5.46)
16: length 38.2
  Top Layer w0.254: v1(33.53,25.78) 35.56,27.81 35.56,30.74 38.42,33.6 40.42,33.6 U2.16 ; v1(28.57,7.62) 28.57,3.05 U5.3
  Bottom Layer w0.254: v1(33.53,25.78) 28.57,20.83 v1(28.57,7.62)
17: length 38
  Top Layer w0.254: v1(29.34,10.03) 29.34,22.12 32.41,25.2 33.77,25.2 35.92,27.34 35.92,30.6 38.52,33.2 40.42,33.2 U2.17
  Bottom Layer w0.254: v1(29.34,10.03) 30.03,9.34 U5.4
18: length 35.2
  Top Layer w0.254: v1(36.7,26.67) 36.7,30.86 38.69,32.85 39.96,32.85 39.98,32.83 40.42,32.83 U2.18
  Bottom Layer w0.254: U5.5 32.57,22.54 v1(36.7,26.67)
19: length 38.4
  Top Layer w0.254: v1(36.45,14.61) 36.45,12.57 36.63,12.39 36.88,12.39 37.06,12.57 37.06,26.2 37.29,26.43 37.29,26.91 37.06,27.14 37.06,30.67 38.8,32.41 U2.19
  Bottom Layer w0.254: U5.6 35.11,13.27 v1(36.45,14.61)
20: length 31.7
  Top Layer w0.254: v1(39.12,27.18) 39.5,27.56 39.5,31.88 39.68,32.06 39.95,32.06 39.98,32.03 40.42,32.03 U2.20
  Bottom Layer w0.254: v1(39.12,27.18) 37.65,25.72 U5.7
21: length 30
  Top Layer w0.254: v1(39.62,18.16) 39.62,26.86 39.85,27.09 39.85,29.22 U2.21
  Bottom Layer w0.254: v1(39.62,18.16) 39.62,2.54 U5.8
22: length 30.2
  Top Layer w0.254: v1(40.77,25.78) 40.77,29.3 41.93,30.46 41.93,30.9 U2.22
  Bottom Layer w0.254: v1(40.77,25.78) 42.73,23.81 U5.9
23: length 31.9
  Top Layer w0.254: U5.10 45.27,3.62 v1(41.28,7.62) ; v1(40.77,17.78) 42.34,19.35 42.34,23.28 41.82,23.8 41.82,26.23 42.34,26.76 U2.23
  Bottom Layer w0.254: v1(41.28,7.62) 40.77,8.13 v1(40.77,17.78)
24: length 30.9
  Top Layer w0.254: U5.11 47.81,15.18 v1(45.21,17.78) ; U2.25 43.15,30.9 43.15,30.46 43.18,30.43 v1(43.18,27.31)
  Bottom Layer w0.254: v1(43.18,27.31) 45.21,25.27 v1(45.21,17.78)
25: length 31.8
  Top Layer w0.254: U2.26 43.55,30.9 43.55,30.46 43.81,30.19 v1(43.81,27.94)
  Bottom Layer w0.254: U5.12 50.35,21.4 v1(43.81,27.94)
26: length 36.5
  Top Layer w0.254: v1(43.94,32) 43.94,30.91 U2.27
  Bottom Layer w0.254: v1(43.94,32) 46.74,32 52.89,25.85 U5.13
27: length 54
  Top Layer w0.254: v1(44.83,32.89) 44.53,32.59 44.53,31.76 44.34,31.58 U2.28 ; v1(54.23,23.37) 49.76,27.83 49.76,27.94 49.58,28.12 49.33,28.12 49.15,27.94 49.15,26.33 50.89,24.59 50.89,23.2 50.52,22.83 50.16,22.83 49.15,21.82 49.15,8.26 U5.14
  Bottom Layer w0.254: v1(44.83,32.89) 44.83,32.77 45.24,32.36 46.88,32.36 53.25,25.99 53.25,24.35 v1(54.23,23.37)
30: length 32.9
  Top Layer w0.254: U2.38 48.35,30.9 48.35,30.36 57.97,20.73 U5.15
31: length 34.1
  Top Layer w0.254: U5.16 60.51,19.13 49.35,30.3 48.91,30.3 48.75,30.46 48.75,30.9 U2.39
32: length 24.5
  Top Layer w0.254: U4.1 54.49,30.91 U2.40
33: length 22.9
  Top Layer w0.254: U2.42 55.52,32.41 U4.2
34: length 22
  Top Layer w0.254: U2.43 57.66,32.81 U4.3
35: length 21.2
  Top Layer w0.254: U4.4 59.8,33.21 U2.44
36: length 20.3
  Top Layer w0.254: U2.45 61.94,33.61 U4.5
37: length 19.4
  Top Layer w0.254: U2.46 50.26,34 62.06,34 65.97,30.09 U4.6
38: length 18.5
  Top Layer w0.254: U4.7 66.22,34.41 U2.47
39: length 17.9
  Top Layer w0.254: U2.48 50.26,34.83 67.66,34.83 U4.8
40: length 18.8
  Top Layer w0.254: U4.9 65.51,35.21 U2.49
41: length 19.3
  Top Layer w0.254: U2.52 64.17,36.41 U4.10
42: length 20.2
  Top Layer w0.254: U2.53 62.03,36.81 U4.11
43: length 21.1
  Top Layer w0.254: U4.12 59.89,37.21 U2.54
44: length 22
  Top Layer w0.254: U2.55 57.75,37.61 U4.13
45: length 22.9
  Top Layer w0.254: U2.56 55.61,38.01 U4.14
46: length 25
  Top Layer w0.254: U2.57 55.51,38.41 66.83,49.73 66.83,50.9 68.01,52.08 U4.15
47: length 27.1
  Top Layer w0.254: U4.16 65.7,53.18 65.7,49.11 55.41,38.81 U2.58
CLK: length 33.1
  Top Layer w0.254: Debug.1 66.5,12.38 66.5,13.05 66.68,13.22 v1(66.68,13.84) ; v1(47.5,32.77) 47.5,32.7 46.35,31.56 46.35,30.92 U2.33
  Bottom Layer w0.254: v1(47.5,32.77) 47.5,32.58 47.9,32.17 47.9,31.84 65.9,13.84 v1(66.68,13.84)
LED2: length 54.7
  Top Layer w0.254: v1(46.61,28.7) 45.97,28.07 45.97,27.92 46.08,27.81 46.23,27.81 47.54,29.12 U2.36 ; v1(7.37,11.43) 4.3,11.43 USR1.2
  Bottom Layer w0.254: v1(7.37,11.43) 24.64,28.7 v1(46.61,28.7)
LED3: length 62
  Top Layer w0.254: U2.37 47.94,26.31 49.64,24.61 50.37,24.61 50.53,24.45 50.53,23.35 50.37,23.19 48.46,23.19 47.08,21.81 47.08,21.77 46.92,21.61 45.83,21.61 45.63,21.41 45.63,20.35 34.37,9.1 USR2.2
SWD: length 34.6
  Top Layer w0.254: v1(48.26,32.64) 47.14,31.52 46.91,31.52 46.75,31.35 46.75,31.13 46.74,31.12 U2.34 ; Debug.3 64.74,9.45 64.27,9.45 64.1,9.62 64.1,11.45 65.16,12.5 65.16,15.99 v1(54.23,26.92)
  Bottom Layer w0.254: v1(54.23,26.92) 51.51,29.64 50.9,29.64 49.15,31.39 49.15,31.75 v1(48.26,32.64)
USB+: length 51.5
  Top Layer w0.254: R6.2 18.6,45.11 15.04,48.67 15.04,49.93 14.88,50.09 13.62,50.09 12.73,50.98 ; 12.73,50.98 13.07,50.98 13.41,51.32 13.41,51.99 13.16,52.24 12.3,52.24 9.05,55.5 USB1.6 ; 12.73,50.98 11.23,50.98 10.03,52.17 10.03,52.77 8.37,54.42 7.78,54.42 USB1.8
USB-: length 54.7
  Top Layer w0.254: v1(12.83,51.56) 12.7,51.69 v1(11.94,51.69) 11.94,52.07 9.02,54.99 7.71,54.99 USB1.7 ; v1(9.53,55.88) 9.41,56 USB1.5 ; R5.2 43.92,48.89 v1(19.81,48.89)
  Bottom Layer w0.254: 13.84,51.69 13.72,51.56 v1(12.83,51.56) ; 13.84,51.69 13.97,51.82 13.97,51.94 14.1,52.07 13.33,52.07 v1(9.53,55.88) ; 13.84,51.69 13.84,50.17 ; 13.84,50.17 15.11,48.89 v1(19.81,48.89) ; 13.84,50.17 v1(13.21,49.53)
VREGAVDD: length 15.4
  Top Layer w0.254: C6.1 58.29,45.72 v1(57.66,45.08) ; U2.61 50.84,40.72 51.62,41.5 53.44,41.5 R4.2 54.49,42.8 v1(52.83,42.8)
  Bottom Layer w0.254: v1(57.66,45.08) 55.12,45.08 v1(52.83,42.8)
VREGLX: length 13.9
  Top Layer w0.254: U2.63 48.35,40.73 48.35,41.5 48.72,41.86 49.59,41.86 50.27,42.55 51.2,42.55 52.71,44.06 53.32,44.06 53.48,44.22 53.48,45.31 53.69,45.51 54.16,45.51 L1.1
$1N996: length 7.3
  Top Layer w0.254: U2.30 45.13,30.9 45.13,30.02 44.88,29.76 44.88,26.2 44.39,25.72 C1.1
$1N1154: length 3.6
  Top Layer w0.254: C2.2 46.35,23.78 U1.3 48.24,24 R1.1
$1N1283: length 9.6
  Top Layer w0.254: U2.31 45.54,27.48 45.72,27.31 46.44,27.31 46.57,27.18 47.29,27.18 47.46,27.02 47.46,26.29 R1.2
$1N1709: length 12.7
  Top Layer w0.254: USB1.4 8.49,56.5 v1(8.89,56.9) ; R2.2 15.88,49.39 v1(15.88,50.67)
  Bottom Layer w0.254: v1(8.89,56.9) 9.32,56.46 10.21,56.46 14.45,52.22 14.45,51.33 15.11,50.67 v1(15.88,50.67)
$1N1735: length 6.8
  Top Layer w0.254: R3.2 11.43,50.49 11.3,50.62 10.58,50.62 8.54,52.67 8.54,53.24 8.28,53.5 USB1.10
$1N2843: length 3.1
  Top Layer w0.254: 47.71,43.6 47.71,42.39 47.09,41.78 47.09,41.2 47.13,41.17 47.13,40.73 U2.66
$1N2869: length 3.3
  Top Layer w0.254: U2.67 46.74,42.49 45.63,43.6
$1N3024: length 56.8
  Top Layer w0.254: v1(46.48,29.72) 47.14,30.38 U2.35 ; RESET.1 1.12,17.02 v1(3.05,17.02)
  Bottom Layer w0.254: v1(46.48,29.72) 24.26,29.72 6.86,12.32 6.6,12.32 3.05,15.88 v1(3.05,17.02)
$1N3050: length 2.1
  Top Layer w0.254: R7.2 5.49,17.02 RESET.2
$1N3149: length 54.3
  Top Layer w0.254: 35.98,36.62 24.73,25.36 R9.2 ; 35.98,36.62 35.98,37.29 R8.2 ; 35.98,36.62 v1(38.23,38.86) ; v1(43.56,42.16) 43.56,41.18 43.55,41.17 43.55,40.73 U2.75
  Bottom Layer w0.254: v1(43.56,42.16) 38.86,42.16 38.23,41.53 v1(38.23,38.86)
$1N3281: length 2.4
  Top Layer w0.254: R9.1 1.2,21.54 USB Boot.1

## Copper pours and planes (outline as drawn; the poured copper is in the pictures)
GND on Top Layer: 0,70 70,70 70,0 0,0

## Text on the board
Top Silkscreen Layer: Dude 1: Man, this board is massive | Copyright 2026 Julian C | Dude 2: DO YOU KNOW WHAT ELSE IS MASSIVE!? | Reading docs is free. Breaking / A board and having to buy / another isnt. Read the docs | Github.com/MaricanEngineering | Dude 2: | Marican Engineering | This device complies with / Part 15 of the FCC Rules. / Operation is subject to the / following two conditions: / (1) This device may not / cause harmful interference, and / (2) this device must accept / any interference received, including interference / that may cause undesired operation. | Low Taper Fade
